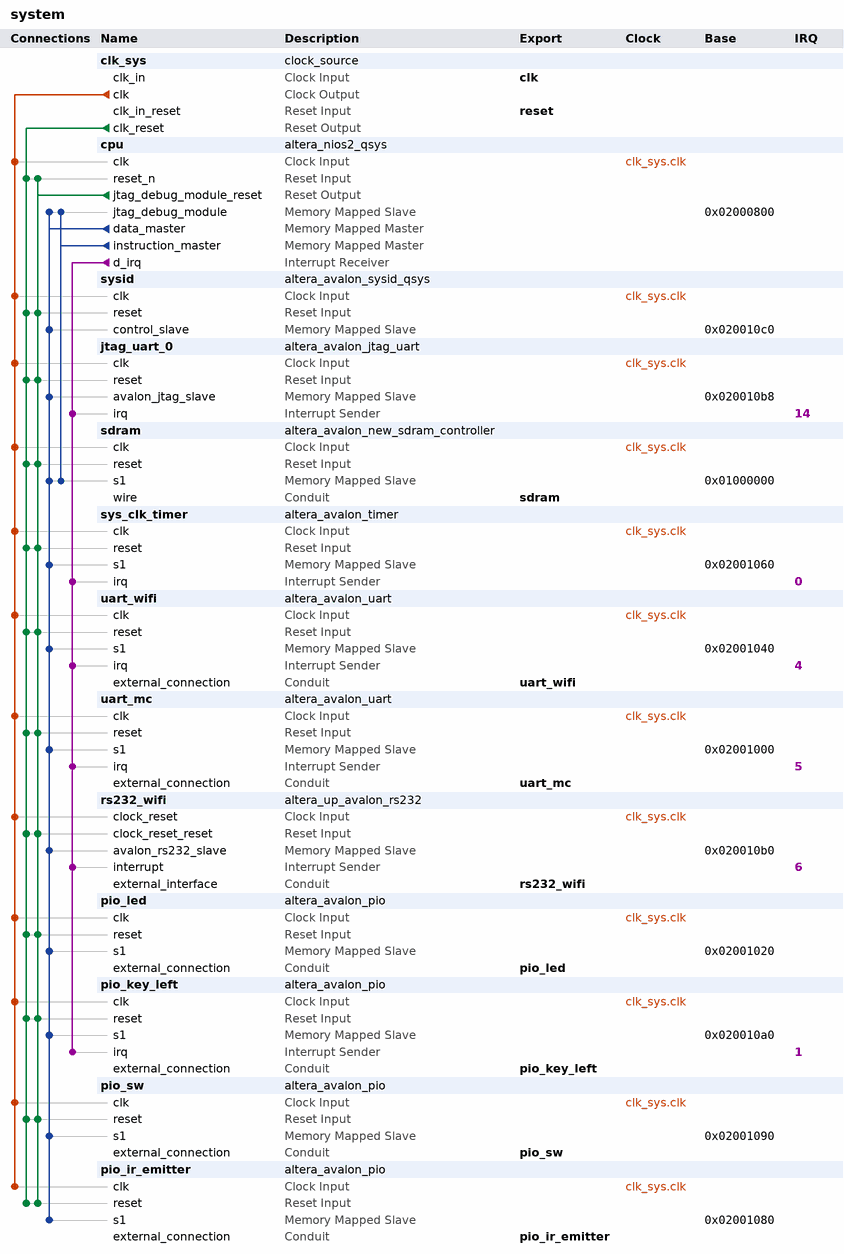
[diagram p0: system contents]
# Platform Designer (Qsys) system system, Cyclone IV E EP4CE22F17C6
# Parameters at their usual value, and those the tool derives, are not listed.
package require -exact qsys 12.1
create_system system
set_project_property DEVICE_FAMILY {Cyclone IV E}
set_project_property DEVICE EP4CE22F17C6

add_instance clk_sys clock_source 12.1
set_instance_parameter_value clk_sys clockFrequency 100000000
set_instance_parameter_value clk_sys resetSynchronousEdges DEASSERT

add_instance cpu altera_nios2_qsys 12.1
set_instance_parameter_value cpu resetSlave sdram.s1
set_instance_parameter_value cpu exceptionSlave sdram.s1
set_instance_parameter_value cpu breakSlave cpu.jtag_debug_module
set_instance_parameter_value cpu impl Fast
set_instance_parameter_value cpu icache_size 8192
set_instance_parameter_value cpu dcache_size 4096

add_instance sysid altera_avalon_sysid_qsys 12.1
set_instance_parameter_value sysid id 0

add_instance jtag_uart_0 altera_avalon_jtag_uart 12.1
set_instance_parameter_value jtag_uart_0 simInteractiveOptions INTERACTIVE_INPUT_OUTPUT

add_instance sdram altera_avalon_new_sdram_controller 12.1
set_instance_parameter_value sdram TAC 5.5
set_instance_parameter_value sdram TRCD 20.0
set_instance_parameter_value sdram TRP 20.0
set_instance_parameter_value sdram casLatency 3
set_instance_parameter_value sdram columnWidth 8
set_instance_parameter_value sdram dataWidth 16
set_instance_parameter_value sdram generateSimulationModel false
set_instance_parameter_value sdram initRefreshCommands 8
set_instance_parameter_value sdram model custom
set_instance_parameter_value sdram numberOfBanks 4
set_instance_parameter_value sdram numberOfChipSelects 1
set_instance_parameter_value sdram powerUpDelay 200.0
set_instance_parameter_value sdram refreshPeriod 7.8125
set_instance_parameter_value sdram rowWidth 13

add_instance sys_clk_timer altera_avalon_timer 12.1
set_instance_parameter_value sys_clk_timer period 1
set_instance_parameter_value sys_clk_timer periodUnits MSEC
set_instance_parameter_value sys_clk_timer timerPreset CUSTOM

add_instance uart_wifi altera_avalon_uart 12.1
set_instance_parameter_value uart_wifi baud 9600
set_instance_parameter_value uart_wifi dataBits 8
set_instance_parameter_value uart_wifi fixedBaud false
set_instance_parameter_value uart_wifi parity NONE
set_instance_parameter_value uart_wifi stopBits 1

add_instance uart_mc altera_avalon_uart 12.1
set_instance_parameter_value uart_mc baud 9600
set_instance_parameter_value uart_mc dataBits 8
set_instance_parameter_value uart_mc fixedBaud true
set_instance_parameter_value uart_mc parity NONE
set_instance_parameter_value uart_mc stopBits 1

add_instance rs232_wifi altera_up_avalon_rs232 12.0
set_instance_parameter_value rs232_wifi baud 9600
set_instance_parameter_value rs232_wifi parity None

add_instance pio_led altera_avalon_pio 12.1
set_instance_parameter_value pio_led bitModifyingOutReg true
set_instance_parameter_value pio_led direction Output
set_instance_parameter_value pio_led width 7

add_instance pio_key_left altera_avalon_pio 12.1
set_instance_parameter_value pio_key_left bitClearingEdgeCapReg true
set_instance_parameter_value pio_key_left captureEdge true
set_instance_parameter_value pio_key_left direction Input
set_instance_parameter_value pio_key_left edgeType ANY
set_instance_parameter_value pio_key_left generateIRQ true
set_instance_parameter_value pio_key_left irqType EDGE
set_instance_parameter_value pio_key_left width 1

add_instance pio_sw altera_avalon_pio 12.1
set_instance_parameter_value pio_sw direction Input
set_instance_parameter_value pio_sw width 4

add_instance pio_ir_emitter altera_avalon_pio 12.1
set_instance_parameter_value pio_ir_emitter direction Output
set_instance_parameter_value pio_ir_emitter width 1

# connections
add_connection clk_sys.clk cpu.clk clock
add_connection clk_sys.clk jtag_uart_0.clk clock
add_connection clk_sys.clk pio_ir_emitter.clk clock
add_connection clk_sys.clk pio_key_left.clk clock
add_connection clk_sys.clk pio_led.clk clock
add_connection clk_sys.clk pio_sw.clk clock
add_connection clk_sys.clk rs232_wifi.clock_reset clock
add_connection clk_sys.clk sdram.clk clock
add_connection clk_sys.clk sys_clk_timer.clk clock
add_connection clk_sys.clk sysid.clk clock
add_connection clk_sys.clk uart_mc.clk clock
add_connection clk_sys.clk uart_wifi.clk clock
add_connection clk_sys.clk_reset cpu.reset_n reset
add_connection clk_sys.clk_reset jtag_uart_0.reset reset
add_connection clk_sys.clk_reset pio_ir_emitter.reset reset
add_connection clk_sys.clk_reset pio_key_left.reset reset
add_connection clk_sys.clk_reset pio_led.reset reset
add_connection clk_sys.clk_reset pio_sw.reset reset
add_connection clk_sys.clk_reset rs232_wifi.clock_reset_reset reset
add_connection clk_sys.clk_reset sdram.reset reset
add_connection clk_sys.clk_reset sys_clk_timer.reset reset
add_connection clk_sys.clk_reset sysid.reset reset
add_connection clk_sys.clk_reset uart_mc.reset reset
add_connection clk_sys.clk_reset uart_wifi.reset reset
add_connection cpu.jtag_debug_module_reset cpu.reset_n reset
add_connection cpu.jtag_debug_module_reset jtag_uart_0.reset reset
add_connection cpu.jtag_debug_module_reset pio_ir_emitter.reset reset
add_connection cpu.jtag_debug_module_reset pio_key_left.reset reset
add_connection cpu.jtag_debug_module_reset pio_led.reset reset
add_connection cpu.jtag_debug_module_reset pio_sw.reset reset
add_connection cpu.jtag_debug_module_reset rs232_wifi.clock_reset_reset reset
add_connection cpu.jtag_debug_module_reset sdram.reset reset
add_connection cpu.jtag_debug_module_reset sys_clk_timer.reset reset
add_connection cpu.jtag_debug_module_reset sysid.reset reset
add_connection cpu.jtag_debug_module_reset uart_mc.reset reset
add_connection cpu.jtag_debug_module_reset uart_wifi.reset reset
add_connection cpu.data_master cpu.jtag_debug_module avalon
set_connection_parameter_value cpu.data_master/cpu.jtag_debug_module baseAddress 0x02000800
add_connection cpu.data_master jtag_uart_0.avalon_jtag_slave avalon
set_connection_parameter_value cpu.data_master/jtag_uart_0.avalon_jtag_slave baseAddress 0x020010b8
add_connection cpu.data_master pio_ir_emitter.s1 avalon
set_connection_parameter_value cpu.data_master/pio_ir_emitter.s1 baseAddress 0x02001080
add_connection cpu.data_master pio_key_left.s1 avalon
set_connection_parameter_value cpu.data_master/pio_key_left.s1 baseAddress 0x020010a0
add_connection cpu.data_master pio_led.s1 avalon
set_connection_parameter_value cpu.data_master/pio_led.s1 baseAddress 0x02001020
add_connection cpu.data_master pio_sw.s1 avalon
set_connection_parameter_value cpu.data_master/pio_sw.s1 baseAddress 0x02001090
add_connection cpu.data_master rs232_wifi.avalon_rs232_slave avalon
set_connection_parameter_value cpu.data_master/rs232_wifi.avalon_rs232_slave baseAddress 0x020010b0
add_connection cpu.data_master sdram.s1 avalon
set_connection_parameter_value cpu.data_master/sdram.s1 baseAddress 0x01000000
add_connection cpu.data_master sys_clk_timer.s1 avalon
set_connection_parameter_value cpu.data_master/sys_clk_timer.s1 baseAddress 0x02001060
add_connection cpu.data_master sysid.control_slave avalon
set_connection_parameter_value cpu.data_master/sysid.control_slave baseAddress 0x020010c0
add_connection cpu.data_master uart_mc.s1 avalon
set_connection_parameter_value cpu.data_master/uart_mc.s1 baseAddress 0x02001000
add_connection cpu.data_master uart_wifi.s1 avalon
set_connection_parameter_value cpu.data_master/uart_wifi.s1 baseAddress 0x02001040
add_connection cpu.instruction_master cpu.jtag_debug_module avalon
set_connection_parameter_value cpu.instruction_master/cpu.jtag_debug_module baseAddress 0x02000800
add_connection cpu.instruction_master sdram.s1 avalon
set_connection_parameter_value cpu.instruction_master/sdram.s1 baseAddress 0x01000000
add_connection cpu.d_irq jtag_uart_0.irq interrupt
set_connection_parameter_value cpu.d_irq/jtag_uart_0.irq irqNumber 14
add_connection cpu.d_irq pio_key_left.irq interrupt
set_connection_parameter_value cpu.d_irq/pio_key_left.irq irqNumber 1
add_connection cpu.d_irq rs232_wifi.interrupt interrupt
set_connection_parameter_value cpu.d_irq/rs232_wifi.interrupt irqNumber 6
add_connection cpu.d_irq sys_clk_timer.irq interrupt
set_connection_parameter_value cpu.d_irq/sys_clk_timer.irq irqNumber 0
add_connection cpu.d_irq uart_mc.irq interrupt
set_connection_parameter_value cpu.d_irq/uart_mc.irq irqNumber 5
add_connection cpu.d_irq uart_wifi.irq interrupt
set_connection_parameter_value cpu.d_irq/uart_wifi.irq irqNumber 4

# exported interfaces
add_interface clk clock sink
set_interface_property clk EXPORT_OF clk_sys.clk_in
add_interface reset reset sink
set_interface_property reset EXPORT_OF clk_sys.clk_in_reset
add_interface sdram conduit end
set_interface_property sdram EXPORT_OF sdram.wire
add_interface uart_wifi conduit end
set_interface_property uart_wifi EXPORT_OF uart_wifi.external_connection
add_interface pio_led conduit end
set_interface_property pio_led EXPORT_OF pio_led.external_connection
add_interface pio_key_left conduit end
set_interface_property pio_key_left EXPORT_OF pio_key_left.external_connection
add_interface pio_sw conduit end
set_interface_property pio_sw EXPORT_OF pio_sw.external_connection
add_interface pio_ir_emitter conduit end
set_interface_property pio_ir_emitter EXPORT_OF pio_ir_emitter.external_connection
add_interface uart_mc conduit end
set_interface_property uart_mc EXPORT_OF uart_mc.external_connection
add_interface rs232_wifi conduit end
set_interface_property rs232_wifi EXPORT_OF rs232_wifi.external_interface

save_system system.qsys
